# EAGLE design mb_01 (EAGLE 7.6.0)

## Sheet 1 of 3
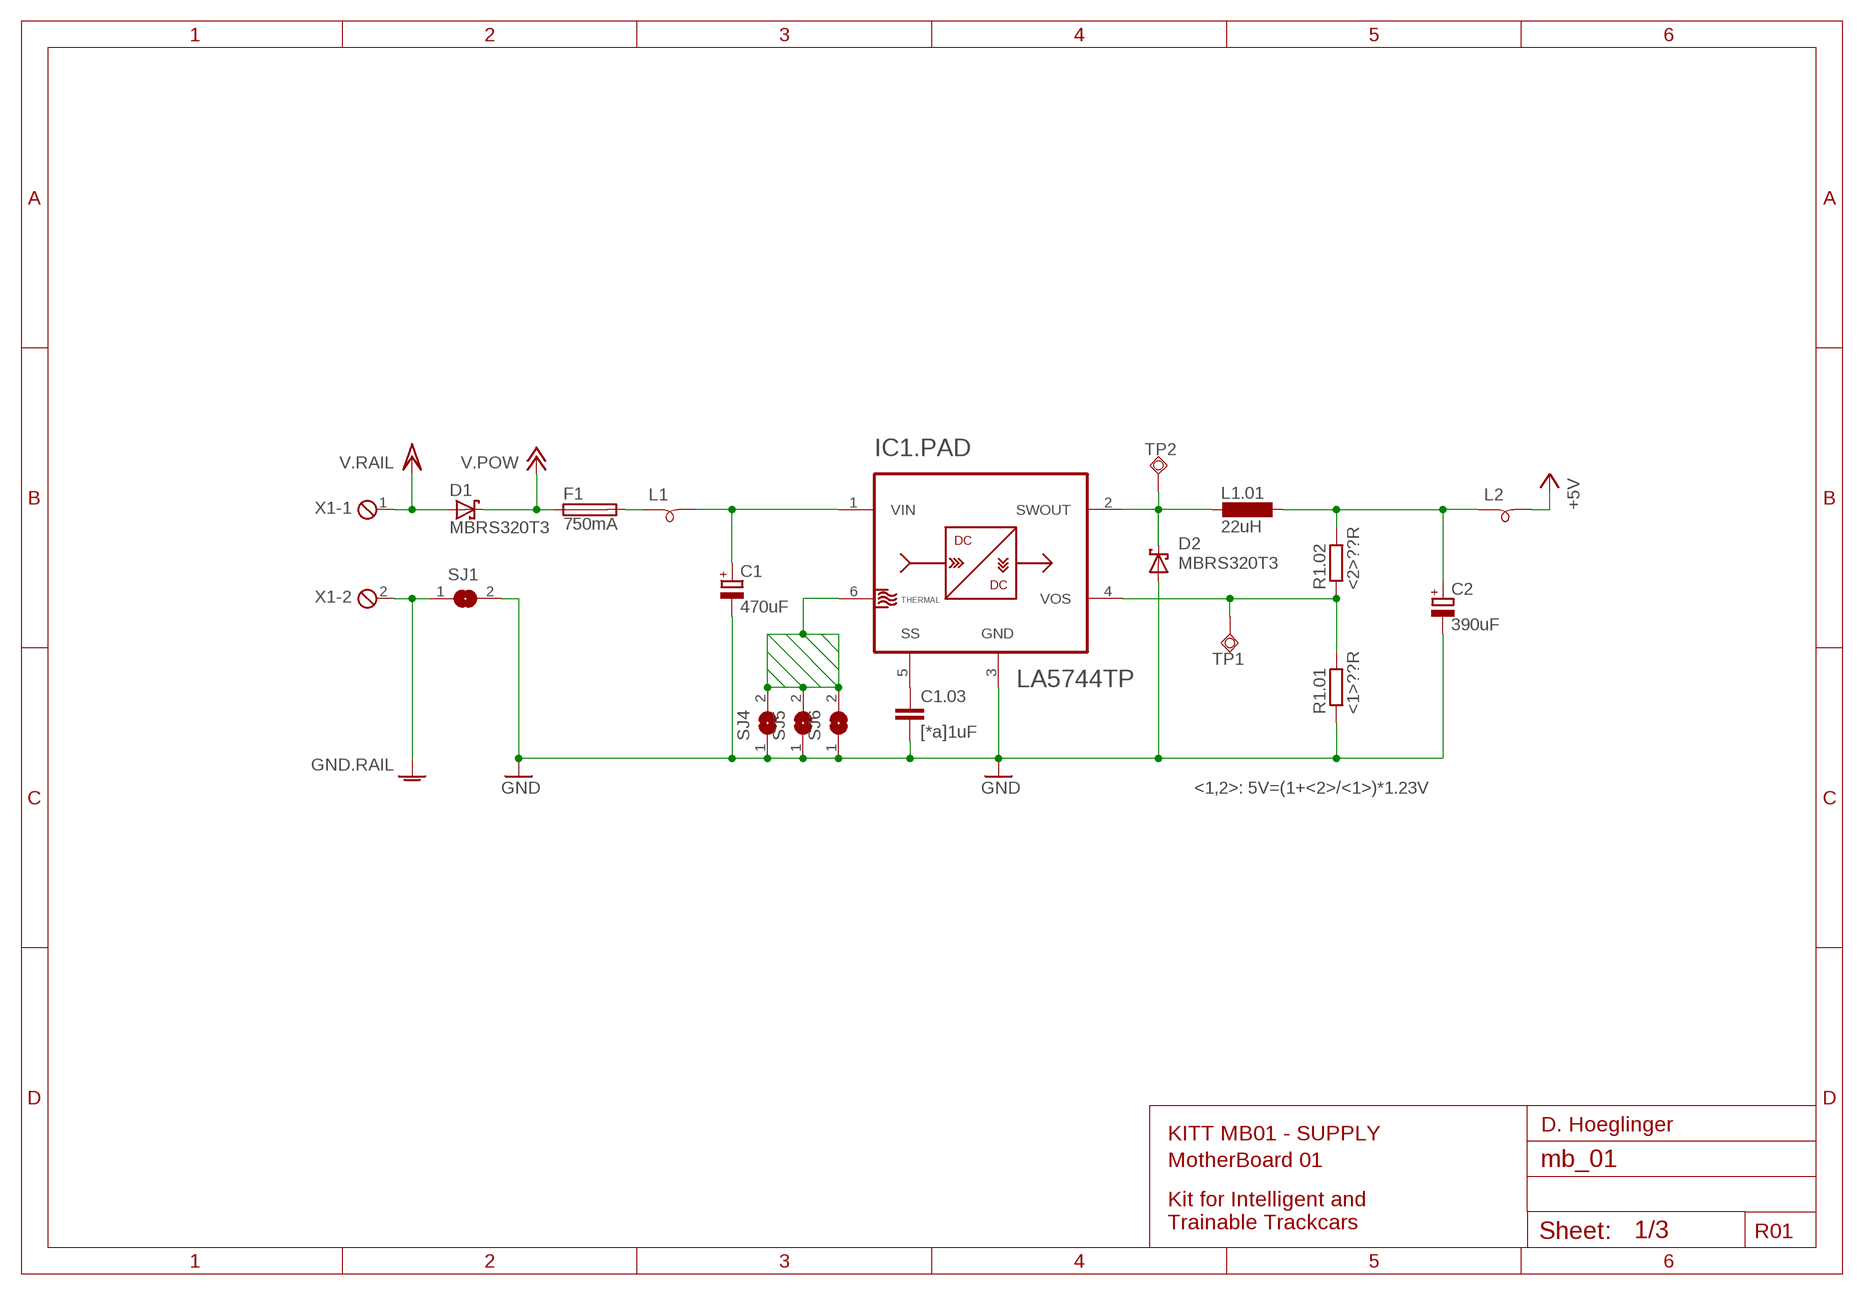
[diagram p0: schematic, sheet 1]

### Parts
C1  470uF  CPOL-EUSMCP  [SMC_P]
C1.03  [*a]1uF  C-EUC0805K  [C0805K]
C2  390uF  CPOL-EUSMCP  [SMC_P]
D1  MBRS320T3  [SMC]
D2  MBRS320T3  [SMC]
F1  750mA  MF-SMDF050  [MF-SMDF050]
IC1  LA5744TP  [TP-HPA]
L1  SM-B5  [SM-B5]
L1.01  22uH  L-EUWE-TPC  [POWER-CHOKE_WE-TPC]
L2  SM-B5  [SM-B5]
R1.01  <1>??R  R-EU_R0805  [R0805]
R1.02  <2>??R  R-EU_R0805  [R0805]
SJ1  SJ  [SJ]
SJ4  SJ  [SJ]
SJ5  SJ  [SJ]
SJ6  SJ  [SJ]
TP1  TPSQTP19SQ  [TP19SQ]
TP2  TPSQTP19SQ  [TP19SQ]
X1  MPT2  [2POL254]

### Nets
+5V: L2.2
+12V: D1.C F1.1 ; supply symbol labelled V.POW
GND: C1.03.2 C1.- C2.- D2.A IC1.3(.PAD:GND) R1.01.1 SJ1.2 SJ4.1 SJ5.1 SJ6.1 ; also sheet 2,3
GNDA: SJ1.1 X1.2 ; supply symbol labelled GND.RAIL
N$1: C1.03.1 IC1.5(.PAD:SS)
N$2: F1.2 L1.1
N$3: C1.+ IC1.1(.PAD:VIN) L1.2
N$4: IC1.4(.PAD:VOS) R1.01.2 R1.02.1 TP1.TP
N$5: D2.C IC1.2(.PAD:SWOUT) L1.01.2 TP2.TP
N$7: C2.+ L1.01.1 L2.1 R1.02.2
THERM.1: IC1.6(THERMAL) SJ4.2 SJ5.2 SJ6.2
VCC/2: D1.A X1.1 ; supply symbol labelled V.RAIL ; also sheet 3

### Notes on the sheet
- <1,2>: 5V=(1+<2>/<1>)*1.23V
- D. Hoeglinger
- KITT MB01 | - SUPPLY
- MotherBoard 01
- Kit for Intelligent and
  Trainable Trackcars
- R01

## Sheet 2 of 3
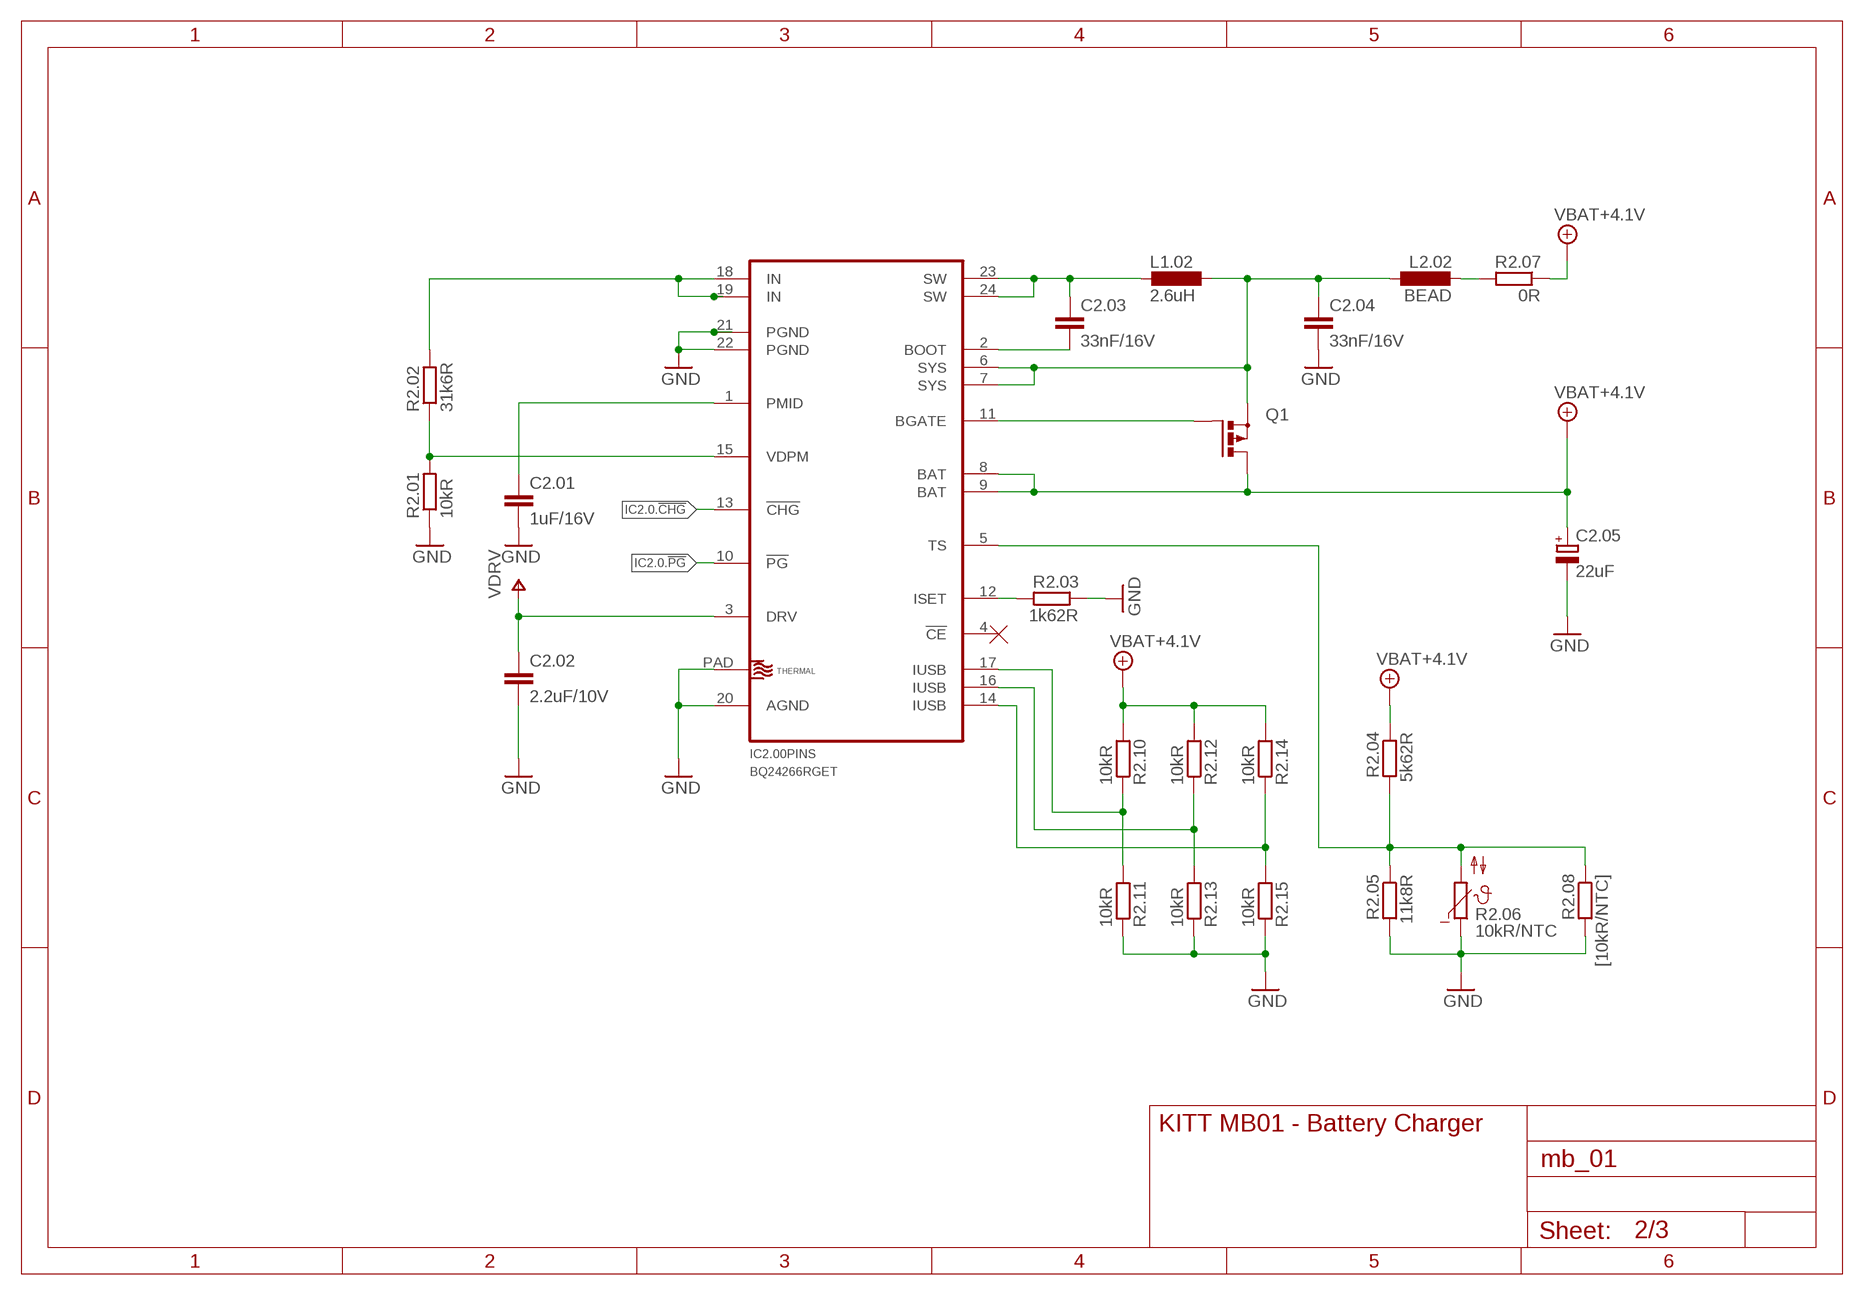
[diagram p1: schematic, sheet 2]

### Parts
C2.01  1uF/16V  C-EUC0805  [C0805]
C2.02  2.2uF/10V  C-EUC0805  [C0805]
C2.03  33nF/16V  C-EUC0603  [C0603]
C2.04  33nF/16V  C-EUC0805  [C0805]
C2.05  22uF  CPOL-EUA/3216-18R  [A/3216-18R]
IC2.00  BQ24266RGET  [VQFN-24]
L1.02  2.6uH  L-EUWE-TPC  [POWER-CHOKE_WE-TPC]
L2.02  BEAD  L-EUL2012C  [L2012C]
Q1  P-MOSFET-SO8  [SO-08]
R2.01  10kR  R-EU_R0402  [R0402]
R2.02  31k6R  R-EU_R0402  [R0402]
R2.03  1k62R  R-EU_R0402  [R0402]
R2.04  5k62R  R-EU_R0402  [R0402]
R2.05  11k8R  R-EU_R0402  [R0402]
R2.06  10kR/NTC  V642  [P642]
R2.07  0R  R-EU_R0402  [R0402]
R2.08  [10kR/NTC]  R-EU_R0402  [R0402]
R2.10  10kR  R-EU_R0402  [R0402]
R2.11  10kR  R-EU_R0402  [R0402]
R2.12  10kR  R-EU_R0402  [R0402]
R2.13  10kR  R-EU_R0402  [R0402]
R2.14  10kR  R-EU_R0402  [R0402]
R2.15  10kR  R-EU_R0402  [R0402]

### Nets
+4.1V: C2.05.+ IC2.00.8(PINS:BAT) IC2.00.9(PINS:BAT) Q1.5(D) Q1.6(D) Q1.7(D) Q1.8(D) R2.04.1 R2.07.1 R2.10.2 R2.12.2 R2.14.2 ; supply symbol labelled VBAT+4.1V
GND: C2.01.2 C2.02.2 C2.04.2 C2.05.- IC2.00.20(PINS:AGND) IC2.00.21(PINS:PGND) IC2.00.22(PINS:PGND) IC2.00.PAD(PAD:THERMAL) R2.01.1 R2.03.1 R2.05.2 R2.06.1 R2.08.2 R2.11.1 R2.13.1 R2.15.1 ; also sheet 1,3
IC2.0.!CHG: IC2.00.13(PINS:!CHG)
IC2.0.!PG: IC2.00.10(PINS:!PG)
N$8: C2.01.1 IC2.00.1(PINS:PMID)
N$9: IC2.00.18(PINS:IN) IC2.00.19(PINS:IN) R2.02.2
N$11: IC2.00.15(PINS:VDPM) R2.01.2 R2.02.1
N$12: C2.03.1 IC2.00.23(PINS:SW) IC2.00.24(PINS:SW) L1.02.2
N$13: C2.03.2 IC2.00.2(PINS:BOOT)
N$14: IC2.00.11(PINS:BGATE) Q1.4(G)
N$15: IC2.00.5(PINS:TS) R2.04.2 R2.05.1 R2.06.2 R2.08.1
N$16: L2.02.2 R2.07.2
N$18: C2.04.1 IC2.00.6(PINS:SYS) IC2.00.7(PINS:SYS) L1.02.1 L2.02.1 Q1.1(S) Q1.2(S) Q1.3(S)
N$19: IC2.00.12(PINS:ISET) R2.03.2
N$20: IC2.00.17(PINS:IUSB) R2.10.1 R2.11.2
N$21: IC2.00.16(PINS:IUSB) R2.12.1 R2.13.2
N$22: IC2.00.14(PINS:IUSB) R2.14.1 R2.15.2
V+: C2.02.1 IC2.00.3(PINS:DRV) ; supply symbol labelled VDRV
Unconnected: IC2.00.4(PINS:!CE)

### Notes on the sheet
- KITT MB01 - Battery Charger

## Sheet 3 of 3
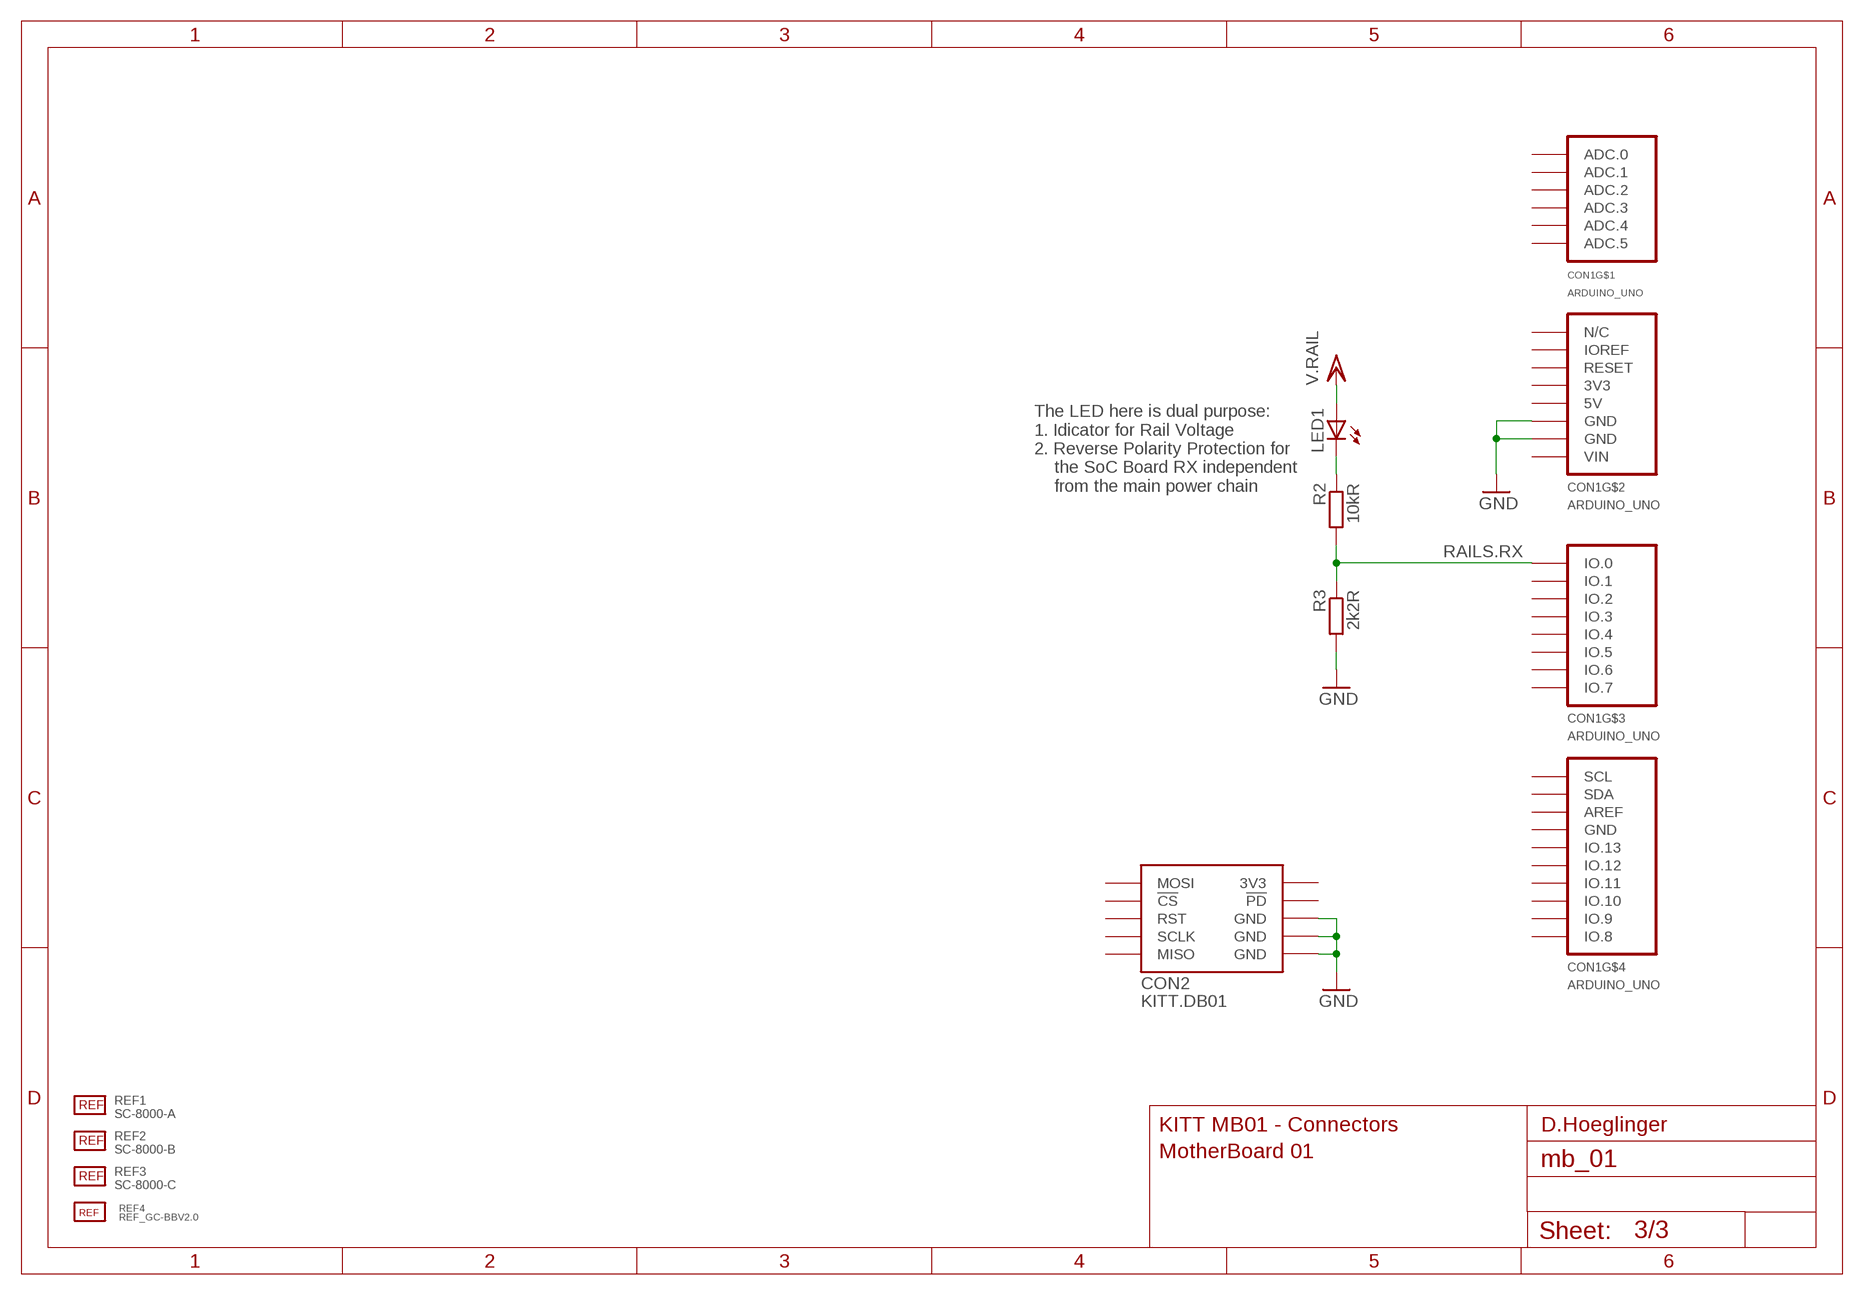
[diagram p2: schematic, sheet 3]

### Parts
CON1  ARDUINO_UNO  [AU_PINS]
CON2  KITT.DB01  [KITT_DB01]
LED1  LG_T679-E1F1-1  [PLCC2]
R2  10kR  R-EU_M0805  [M0805]
R3  2k2R  R-EU_M0805  [M0805]
REF1  SC-8000-A  [SC-8000-A]
REF2  SC-8000-B  [SC-8000-B]
REF3  SC-8000-C  [SC-8000-C]
REF4  REF_GC-BBV2.0  [REF_GHOSTCAR]

### Nets
GND: CON1.GND2(GND) CON1.GND3(GND) CON2.6(GND) CON2.8(GND) CON2.10(GND) R3.2 ; also sheet 1,2
N$10: LED1.C R2.1
RAILS.RX: CON1.IO.0 R2.2 R3.1
VCC/2: LED1.A ; supply symbol labelled V.RAIL ; also sheet 1
Unconnected: CON1.3.3V(3V3) CON1.5V CON1.ADC.0 CON1.ADC.1 CON1.ADC.2 CON1.ADC.3 CON1.ADC.4 CON1.ADC.5 CON1.AREF CON1.GND.1(GND) CON1.I/OREF(IOREF) CON1.IO.1 CON1.IO.2 CON1.IO.3 CON1.IO.4 CON1.IO.5 CON1.IO.6 CON1.IO.7 CON1.IO.8 CON1.IO.9 CON1.IO.10 CON1.IO.11 CON1.IO.12 CON1.IO.13 CON1.N/C CON1.RESET CON1.SCL CON1.SDA CON1.VIN CON2.1(MOSI) CON2.2(3V3) CON2.3(!CS) CON2.4(!PD) CON2.5(RST) CON2.7(SCLK) CON2.9(MISO)

### Notes on the sheet
- The LED here is dual purpose:
  1. Idicator for Rail Voltage
  2. Reverse Polarity Protection for
      the SoC Board RX independent
      from the main power chain
- KITT MB01 - Connectors | D.Hoeglinger
- MotherBoard 01

## Library data of the parts
C1 C2 C2.05 = rcl:CPOL-EU: POLARIZED CAPACITOR, European symbol
C1.03 C2.01-C2.04 = rcl:C-EU: CAPACITOR, European symbol
CON1 = kitt.con:ARDUINO_UNO
CON2 = kitt.con:KITT.DB01
D1 D2 = diode:MBRS3*0T3: SCHOTTKY BARRIER RECTIFIER 3.0 AMPERES 20, 30, 40 VOLT Source: MBRS340T3-D.pdf
F1 = fuse:MF-SMDF: MF-SMDF Series - PRC Resettable Fuses Source: http://www.farnell.com/datasheets/716597.pdf
IC1 = kitt.ic:LA5744TP
IC2.00 = kitt.ic:BQ24266RGET
L1 L2 = inductor-neosid:SM-B: INDUCTOR SMD Bead inductor; OC_FARNELL: unknown; OC_NEWARK: unknown
L1.01 L1.02 L2.02 = rcl:L-EU: INDUCTOR, European symbol
LED1 = led:*_T679-?-1: LC TOPLED® Low Current LED Source: http://catalog.osram-os.com .. LG_LS_LY_T679_OBS.pdf; COLOR: green
Q1 = transistor-power:P-MOSFET-SO8: P-Channel MOSFET Example: FDS4435A; P-Channel Logic Level PowerTrench® MOSFET FDS4465; P-Channel 1.8V Specified PowerTrench® MOSFET Source: www.fairchildsemi.com
R1.01 R1.02 R2 R2.01-R2.05 R2.07 R2.08 R2.10-R2.15 R3 = rcl:R-EU_: RESISTOR, European symbol
R2.06 = ptc-ntc:V642: VALVO NTC; OC_FARNELL: unknown; OC_NEWARK: unknown
REF1 = scaleauto:SC-8000-A
REF2 = scaleauto:SC-8000-B
REF3 = scaleauto:SC-8000-C
REF4 = kitt.con:REF_GC-BBV2.0
SJ1 SJ4-SJ6 = jumper:SJ: SMD solder JUMPER
TP1 TP2 = testpad:TPSQ: Test pad
X1 = con-phoenix-254:MPT2: PHOENIX CONNECTOR; OC_FARNELL: unknown; OC_NEWARK: unknown

## Board
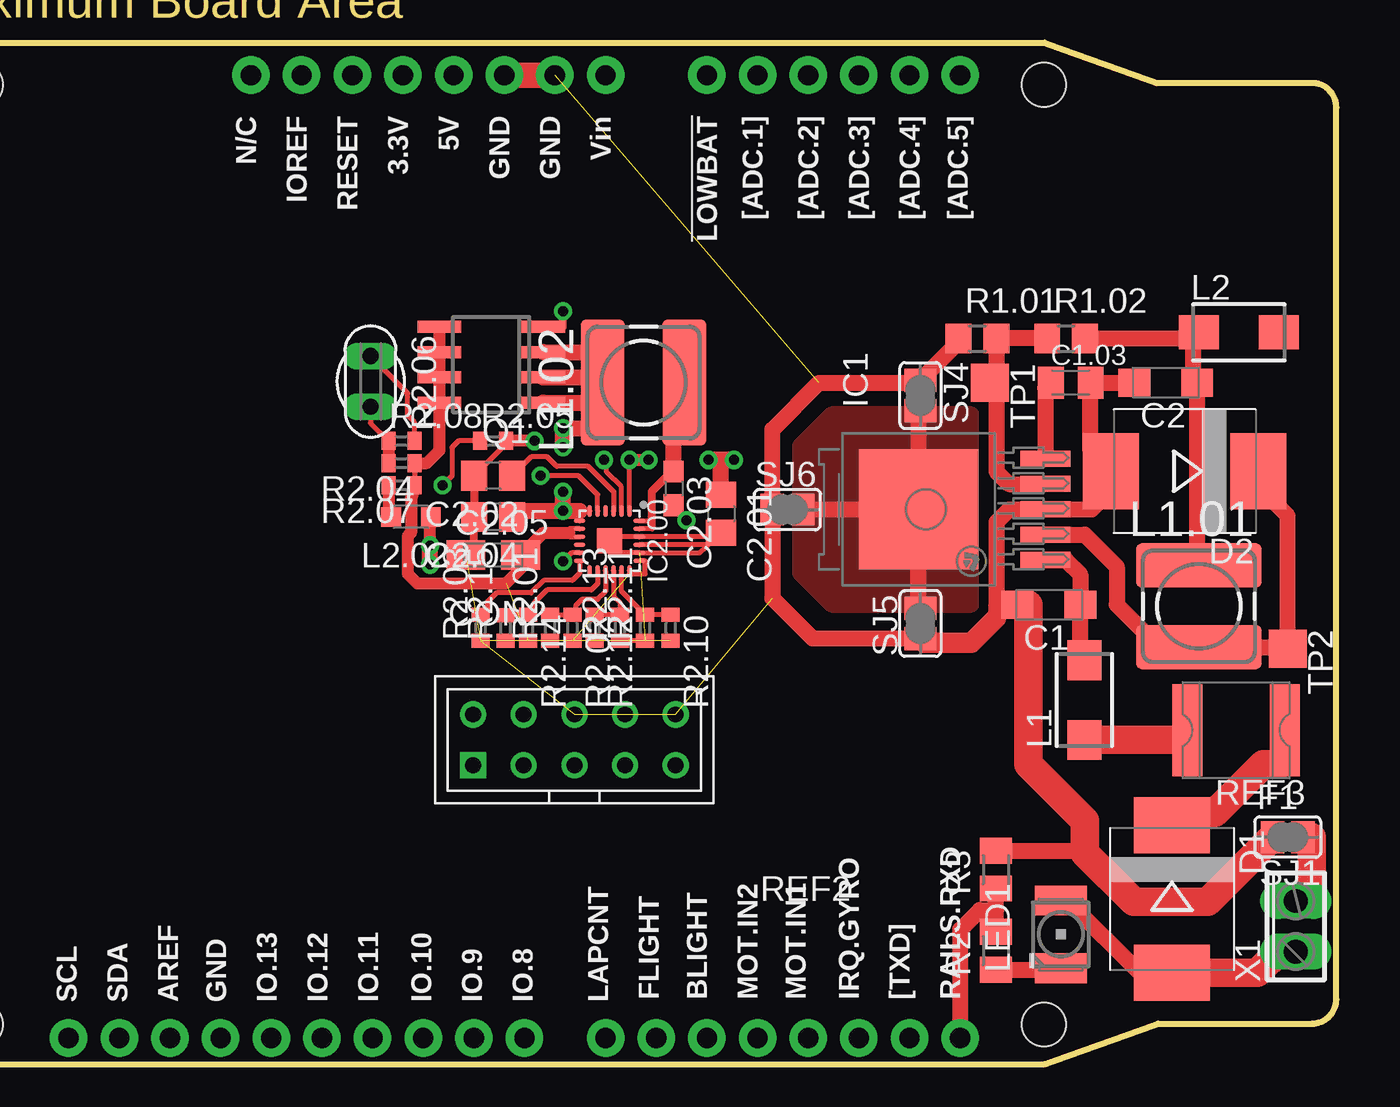
[diagram p3: board, top side]
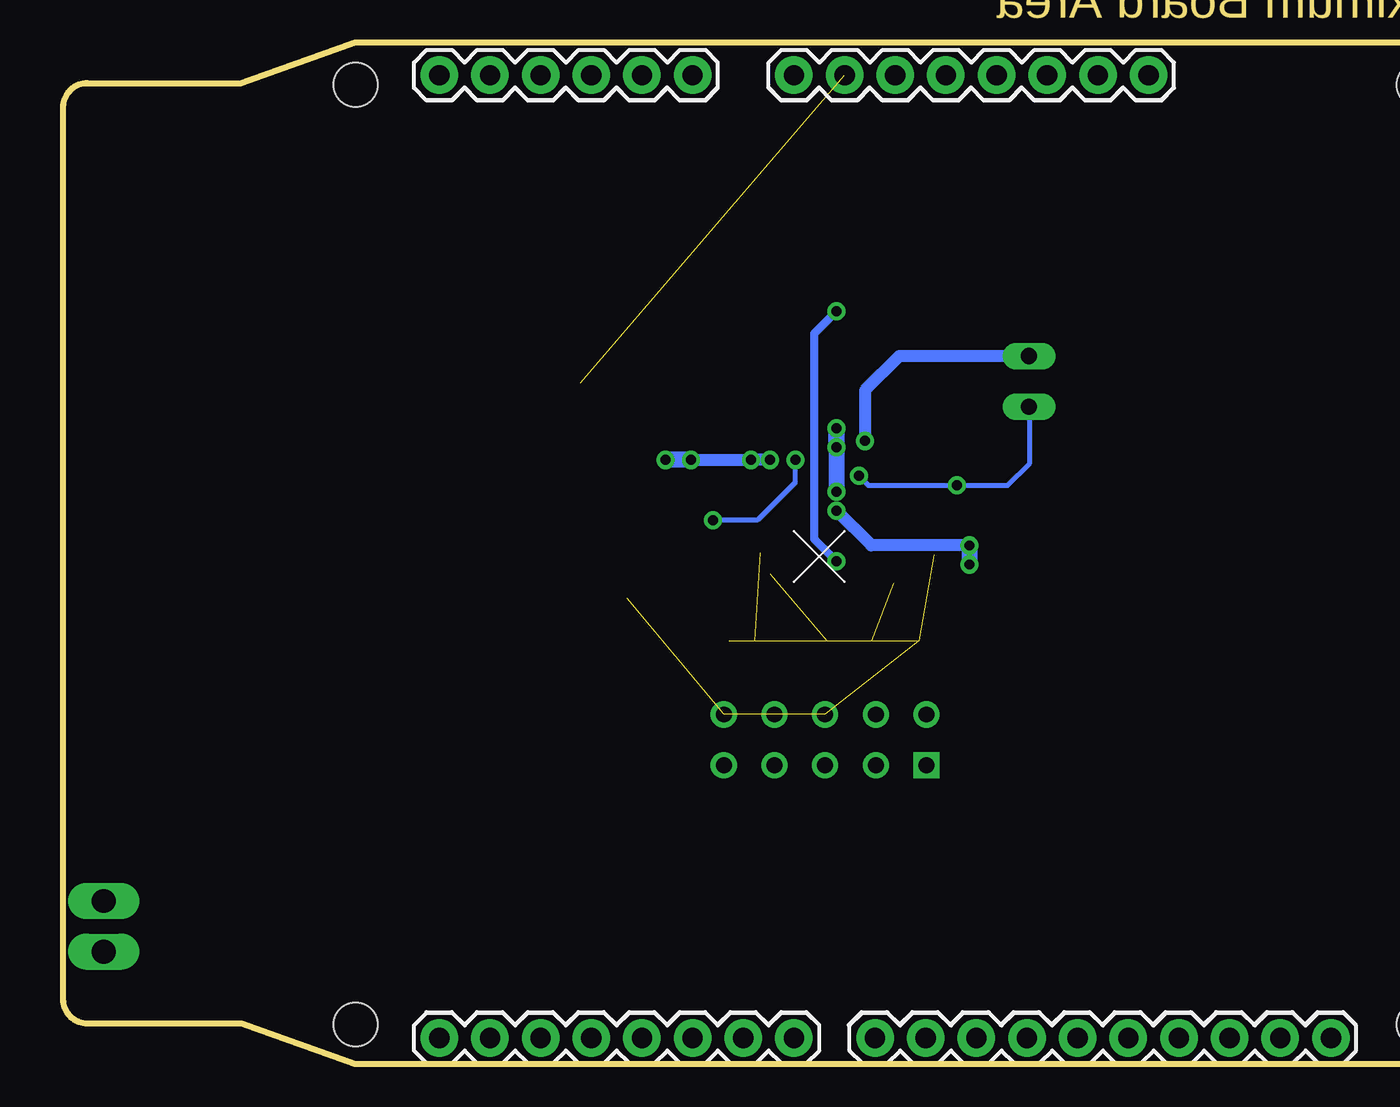
[diagram p4: board, bottom side, seen from below]

No outline drawn. Coordinates in mm, seen from the top.
Copper layers (1*16): Top 0.035mm / dielectric 1.5mm / Bottom 0.035mm
Design rules "default": minimum track width 10mil, minimum drill 24mil, track to track 8mil, track to pad 8mil, pad to pad 8mil, via to via 8mil, smd to smd 8mil, copper to edge 40mil, drill to drill 8mil, minimum pad ring 10mil, minimum via ring 8mil, stop-mask expansion 4mil, vias tented up to drill 0mil, thermal gap 10mil
Holes 2.2 mm at 49.08,23.93 102.37,23.93 49.08,71.04 102.37,71.04
Milling: 14 lines

### Footprints (pad centres in the part's own frame; a part is rotated, then mirrored left to right if it is on the bottom)
SMC_P = smd 1.6 x 1.4: + -1.575,0; - 1.575,0
C0805K = smd 1.3 x 1.6: 1 -1,0; 2 1,0
C0805 = smd 1.3 x 1.5: 1 -0.95,0; 2 0.95,0
C0603 = smd 1.1 x 1: 1 -0.85,0; 2 0.85,0
A/3216-18R = smd 1.95 x 1.5: + 1.375,0; - -1.375,0
AU_PINS = drill 1.016 pad 1.88: 3.3V -8.89,-24.13; 5V -6.35,-24.13; ADC.0 6.35,-24.13; ADC.1 8.89,-24.13; ADC.2 11.43,-24.13; ADC.3 13.97,-24.13; ADC.4 16.51,-24.13; ADC.5 19.05,-24.13; AREF -20.574,24.13; GND2 -1.27,-24.13; GND3 -3.81,-24.13; GND.1 -18.034,24.13; I/OREF -13.97,-24.13; IO.0 19.05,24.13; IO.1 16.51,24.13; IO.2 13.97,24.13; IO.3 11.43,24.13; IO.4 8.89,24.13; IO.5 6.35,24.13; IO.6 3.81,24.13; IO.7 1.27,24.13; IO.8 -2.794,24.13; IO.9 -5.334,24.13; IO.10 -7.874,24.13; IO.11 -10.414,24.13; IO.12 -12.954,24.13; IO.13 -15.494,24.13; N/C -16.51,-24.13; RESET -11.43,-24.13; SCL -25.654,24.13; SDA -23.114,24.13; VIN 1.27,-24.13
KITT_DB01 = drill 0.8 square: 1 -5.08,-1.27 | drill 0.8: 2 -5.08,1.27; 3 -2.54,-1.27; 4 -2.54,1.27; 5 0,-1.27; 6 0,1.27; 7 2.54,-1.27; 8 2.54,1.27; 9 5.08,-1.27; 10 5.08,1.27
SMC = smd 2.8 x 3.8: A 3.7,0; C -3.7,0
MF-SMDF050 = smd 1.5 x 4.6: 1 -2.45,0; 2 2.45,0
TP-HPA = smd 0.8 x 2.5: 1 -2.54,-6.35; 2 -1.27,-6.35; 3 0,-6.35; 4 1.27,-6.35; 5 2.54,-6.35 | smd 6 x 6: 6 0,0
VQFN-24 = smd 0.6 x 0.23: 1 -1.5,1; 2 -1.5,0.6; 3 -1.5,0.2; 4 -1.5,-0.2; 5 -1.5,-0.6; 6 -1.5,-1; 13 1.5,-1; 14 1.5,-0.6; 15 1.5,-0.2; 16 1.5,0.2; 17 1.5,0.6; 18 1.5,1 | smd 0.23 x 0.6: 7 -1,-1.5; 8 -0.6,-1.5; 9 -0.2,-1.5; 10 0.2,-1.5; 11 0.6,-1.5; 12 1,-1.5; 19 1,1.5; 20 0.6,1.5; 21 0.2,1.5; 22 -0.2,1.5; 23 -0.6,1.5; 24 -1,1.5 | smd 1.27 x 1.27: PAD 0,0
SM-B5 = smd 2 x 1.7: 1 -2,0; 2 2,0
POWER-CHOKE_WE-TPC = smd 6.3 x 2.2: 1 0,2.05; 2 0,-2.05
L2012C = smd 1 x 1: 1 -1,0; 2 1,0
PLCC2 = smd 2.6 x 1.5: A 0,1.7; C 0,-1.7
SO-08 = smd 0.6 x 2.2: 1 -1.905,-2.6; 2 -0.635,-2.6; 3 0.635,-2.6; 4 1.905,-2.6; 5 1.905,2.6; 6 0.635,2.6; 7 -0.635,2.6; 8 -1.905,2.6
R0805 = smd 1.3 x 1.5: 1 -0.95,0; 2 0.95,0
M0805 = smd 1.3 x 1.6: 1 -0.95,0; 2 0.95,0
R0402 = smd 0.7 x 0.9: 1 -0.65,0; 2 0.65,0
P642 = drill 0.813 long: 1 -1.27,0; 2 1.27,0
SJ = smd 1.168 x 1.6: 1 -0.762,0; 2 0.762,0
TP19SQ = smd 1.9 x 1.9: TP 0,0
2POL254 = drill 1.2 long: 1 -1.27,0; 2 1.27,0

### Placement (x,y rotation side)
C1  102.63,44.97 180 top
C1.03  103.72,56.11 0 top
C2  108.48,56.11 180 top
C2.01  86.2,49.53 270 top
C2.02  74.77,51.44 180 top
C2.03  83.82,50.8 270 top
C2.04  74.77,49.37 180 top
C2.05  74.77,47.47 0 top
CON1  79.13,47.38 180 bottom
CON2  78.84,38.2 0 top
D1  108.8,30.23 270 top
D2  109.44,51.66 180 top
F1  112.02,38.68 180 top
IC1  96.1,49.76 90 top
IC2.00  80.6,48.18 270 top
L1  104.41,40.2 90 top
L1.01  110.15,44.9 0 top
L1.02  82.31,56.11 90 top
L2  112.15,58.62 0 top
L2.02  70.64,49.37 180 top
LED1  103.23,28.45 0 top
Q1  74.67,57 90 top
R1.01  99.05,58.32 0 top
R1.02  103.49,58.32 0 top
R2  99.97,27.64 90 top
R2.01  77.63,43.81 90 top
R2.02  78.74,43.81 270 top
R2.03  74.14,43.81 90 top
R2.04  70.17,52.07 180 top
R2.05  74.77,53.18 0 top
R2.06  68.62,56.17 270 top
R2.07  70.17,50.96 180 top
R2.08  70.17,53.18 0 top
R2.10  83.66,43.81 270 top
R2.11  82.39,43.81 90 top
R2.12  79.85,43.81 270 top
R2.13  81.12,43.81 90 top
R2.14  76.52,43.81 270 top
R2.15  75.38,43.81 90 top
R3  99.97,31.7 90 top
REF1  72.3,48.09 0 top
REF2  107.2,47.9 0 top
REF3  127.47,47.63 0 top
REF4  75.2,46.77 180 top
SJ1  114.6,33.32 180 top
SJ4  96.19,55.46 270 top
SJ5  96.19,44.03 90 top
SJ6  89.52,49.75 0 top
TP1  99.68,56.1 270 top
TP2  114.6,42.76 270 top
X1  115.01,28.85 90 top

### Tracks (layer width: path | path; a pad name or v marks a point on that pad's centre or on a via)
+4.1V  (3 unrouted)
  Top 0.254: IC2.00.9 78.62,48.38 78.58,48.58 78.58,48.78 IC2.00.8 | R2.04.1 R2.07.1
  Top 0.61: R2.04.1 71.44,52.07 72.07,52.7 Q1.8 Q1.7 Q1.6 Q1.5 | 78.58,48.58 77.26,48.58 C2.05.+ 76.2,47.41 76.2,46.83 75.41,46.04 70.96,46.04 70.48,46.51 70.48,48.42 70.64,48.58 70.64,50.31 R2.07.1
+12V
  Top 1.016: 114.2,36.98 114.47,37.25 F1.1
  Top 1.422: D1.C 109.82,34.54 110.95,34.54 113.39,36.98 114.2,36.98
GND  (via drill 0.5)  (10 unrouted)
  Top 0.254: R2.11.1 R2.13.1 | IC2.00.PAD 80.8,48.38 IC2.00.22 85.9,48.38 C2.01.2 | 80.64,48.1 80.64,47.58 IC2.00.20 85.1,47.58 C2.01.2 | C2.01.2 85.5,47.98 IC2.00.21 | R2.05.2 75.42,53.03 C2.02.2 | R2.08.2 70.82,54.12 70.48,54.45 70.48,55.57 R2.06.1
  Top 0.406: C2.02.2 C2.04.2 73.82,47.89 C2.05.-
  Top 0.61: v76.83,53.18 R2.05.2
  Top 0.813: C2.- C1.03.2 104.72,52.68 D2.A 105.4,51.32 105.4,50.38 104.76,49.75 101.91,49.75 | 101.91,49.75 101.92,49.76 IC1.3 | 100.64,44.98 101.36,44.98 C1.- 100,44.97 | 101.91,49.75 100.64,49.75 100,49.11 100,44.97 | R1.01.1 98.1,58.13 SJ4.1 96.06,56.1 91.11,56.1 88.76,53.75 SJ6.1 88.76,45.3 90.79,43.27 SJ5.1 | 99.97,44.3 100,44.32 100,44.97 | R3.2 104.31,32.65 104.44,32.51
  Top 1.016: 99.97,44.3 98.75,43.08 96.38,43.08 SJ5.1
  Top 1.27: 100.62,44.97 C1.- | CON1.GND2 CON1.GND3
  Top 1.422: SJ1.2 110.59,30.07 106.88,30.07 104.44,32.51 104.44,34.14 101.6,36.98 101.6,44.97 C1.-
  Bottom 0.61: R2.06.1 75.12,57.44 76.83,55.72 v76.83,53.18
GNDA
  Top 1.016: 115.82,33.33 SJ1.1
  Top 1.422: X1.2 115.82,30.94 115.82,33.33
N$1
  Top 0.813: C1.03.1 102.45,55.84 IC1.5
N$2
  Top 1.422: F1.2 109.08,38.2 L1.1
N$3
  Top 0.813: IC1.1 102.47,47.21 103.49,47.21 104.2,46.5 C1.+ 104.2,42.88 L1.2
N$4
  Top 0.813: R1.02.1 R1.01.2 100,56.73 TP1.TP 99.68,55.78 100,55.46 100,51.65 100.64,51.02 102.44,51.02 IC1.4
N$5
  Top 0.813: IC1.2 104.43,48.49 106.03,46.89 106.03,44.98 107.94,43.08 109.92,43.08 L1.01.2 114.52,42.85 TP2.TP 114.61,49.43 113.02,51.02 113.02,51.54 D2.C
N$7
  Top 0.813: R1.02.2 109.85,58.32 | 109.85,58.32 L2.1 | 109.85,58.32 109.85,56.32 C2.+ 110.06,47.03 L1.01.1
N$8  (via drill 0.5)
  Top 0.254: IC2.00.1 v81.6,52.23
  Top 0.61: v81.6,52.23 v82.55,52.23
  Top 0.813: v85.57,52.23 v86.84,52.23 86.2,52.23 C2.01.1
  Bottom 0.61: v85.57,52.23 v82.55,52.23 v81.6,52.23
  Bottom 0.813: v85.57,52.23 v86.84,52.23
N$9  (1 unrouted)
  Top 0.254: IC2.00.18 81.6,46.51 82.39,46.51 82.39,47.18 IC2.00.19
N$10
  Top 0.813: R2.1 103.16,26.68 LED1.C
N$11
  Top 0.254: IC2.00.15 80.4,45.63 80.01,45.24 79.22,45.24 78.9,44.93 78.9,44.62 R2.02.1 R2.01.2
N$12
  Top 0.254: IC2.00.23 82.75,48.78 82.71,48.9 82.74,49.18 IC2.00.24
  Top 0.406: C2.03.1 83.56,51.49 82.71,50.64 82.71,48.9
  Top 0.813: C2.03.1 83.82,55.57 L1.02.2
N$13  (via drill 0.5)
  Top 0.254: C2.03.2 83.82,49.85 v84.45,49.21 | IC2.00.2 81.2,50.88 80.46,51.62 80.46,52.09 v80.33,52.23
  Bottom 0.254: v80.33,52.23 80.33,51.12 82.23,49.21 v84.45,49.21
N$14  (via drill 0.5)
  Top 0.254: IC2.00.11 78.69,47.58 v78.26,47.15
  Top 0.406: Q1.4 77.28,58.9 78.26,58.9 v78.26,59.69
  Bottom 0.406: v78.26,47.15 79.38,48.26 79.38,58.58 v78.26,59.69
N$15  (via drill 0.5)
  Top 0.254: IC2.00.5 80,50.49 79.06,51.44 v77.15,51.44 | R2.05.1 73.03,53.18 72.71,52.86 72.71,51.44 v72.23,50.96 | R2.06.2 68.62,54.08 R2.08.1
  Top 0.61: R2.08.1 R2.04.2
  Bottom 0.254: v77.15,51.44 76.68,50.96 v72.23,50.96 69.69,50.96 68.58,52.07 68.58,54.86 R2.06.2
N$16
  Top 0.61: R2.07.2 69.52,49.5 L2.02.2
N$18  (via drill 0.5)
  Top 0.254: IC2.00.6 79.1,49.68 IC2.00.7 | 78.26,49.68 v78.26,49.69
  Top 0.61: v71.6,47.94 71.6,49.32 L2.02.1
  Top 0.813: Q1.1 80.26,55.1 | 80.26,55.1 L1.02.1 | Q1.3 80.26,57.64 L1.02.1 | Q1.2 80.26,56.37 L1.02.1 | C2.04.1 76.13,49.68 78.26,49.68 | 78.26,49.68 79.1,49.68 | 80.26,55.1 80.26,53.82 v78.26,53.82 v78.26,52.86 | 78.26,49.68 v78.26,50.64 | v71.6,46.99 v71.6,47.94
  Bottom 0.61: v71.6,47.94 76.52,47.94 v78.26,49.69
  Bottom 0.813: v78.26,52.86 v78.26,53.82 v78.26,50.64 | v71.6,47.94 v71.6,46.99
N$19
  Top 0.254: IC2.00.12 79.1,46.56 78.74,46.2 77.31,46.2 76.68,45.56 74.93,45.56 74.45,45.09 74.45,44.78 R2.03.2
N$20
  Top 0.254: IC2.00.17 81.2,45.66 R2.11.2 R2.10.1
N$21
  Top 0.254: R2.12.1 R2.13.2 81.12,45.09 80.8,45.4 IC2.00.16
N$22
  Top 0.254: IC2.00.14 80,46.03 79.69,45.72 77.47,45.72 76.83,45.09 76.83,44.78 R2.14.1 R2.15.2
RAILS.RX
  Top 0.813: CON1.IO.0 98.18,28.69 99.16,29.67 99.97,29.67 | 99.97,29.67 R3.1 | R2.2 99.97,29.67
THERM.1
  Top 0.813: SJ4.2 96.1,54.61 IC1.6 | SJ5.2 96.1,44.88 IC1.6 | SJ6.2 90.93,49.76 IC1.6
  pour Top (no thermals): 98.73,54.51 91.74,54.51 90.16,52.92 90.16,46.57 91.74,44.98 98.73,44.98
V+
  Top 0.254: IC2.00.3 80.8,50.64 79.53,51.91 77.95,51.91 77.47,52.39 76.67,52.39 C2.02.1
VCC/2
  Top 0.813: LED1.A 103.56,30.15 107.29,26.42 108.69,26.42 D1.A
  Top 1.422: X1.1 114.96,27.64 114.2,27.64 113.09,26.53 D1.A

### Text on the board
Milling: EAGLE EDU LIMIT | Maximum Board Area
Reference: Motor Leads --> | <-- Rail Power Leads